# Altium schematic sheet Sheet.SchDoc
size A4; SheetNumber: 1; SheetTotal: 1
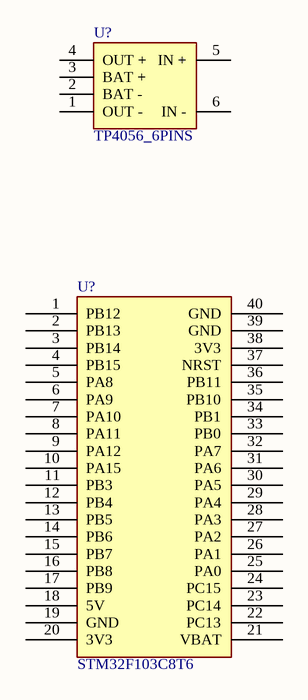
[diagram p0: Sheet.SchDoc]

## Parts
(Parts that share a designator on the sheet are numbered #1, #2 ... from top to bottom, then left to right.)
U?#1  TP4056_6PINS  [TP4056_6PINs]
U?#2  STM32F103C8T6  [Stm32 BluePill]

## Nets

Not connected (* = marked no-connect by the designer): U?#1 1(OUT_-) 2(BAT_-) 3(BAT_+) 4(OUT_+) 5(IN_+) 6(IN_-); U?#2 1(PB12) 2(PB13) 3(PB14) 4(PB15) 5(PA8) 6(PA9) 7(PA10) 8(PA11) 9(PA12) 10(PA15) 11(PB3) 12(PB4) 13(PB5) 14(PB6) 15(PB7) 16(PB8) 17(PB9) 18(5V) 19(GND) 20(3V3) 21(VBAT) 22(PC13) 23(PC14) 24(PC15) 25(PA0) 26(PA1) 27(PA2) 28(PA3) 29(PA4) 30(PA5) 31(PA6) 32(PA7) 33(PB0) 34(PB1) 35(PB10) 36(PB11) 37(NRST) 38(3V3) 39(GND) 40(GND)

## Library data of the parts
U?#1 = TP4056_6PINS: MODULE BATTERY CHARGER 6 PINS
U?#2 = BluePill: Designed By @Alixahedi